# Altium schematic sheet bmsSlave_conn.SchDoc
size A; SheetNumber: 2; SheetTotal: 4
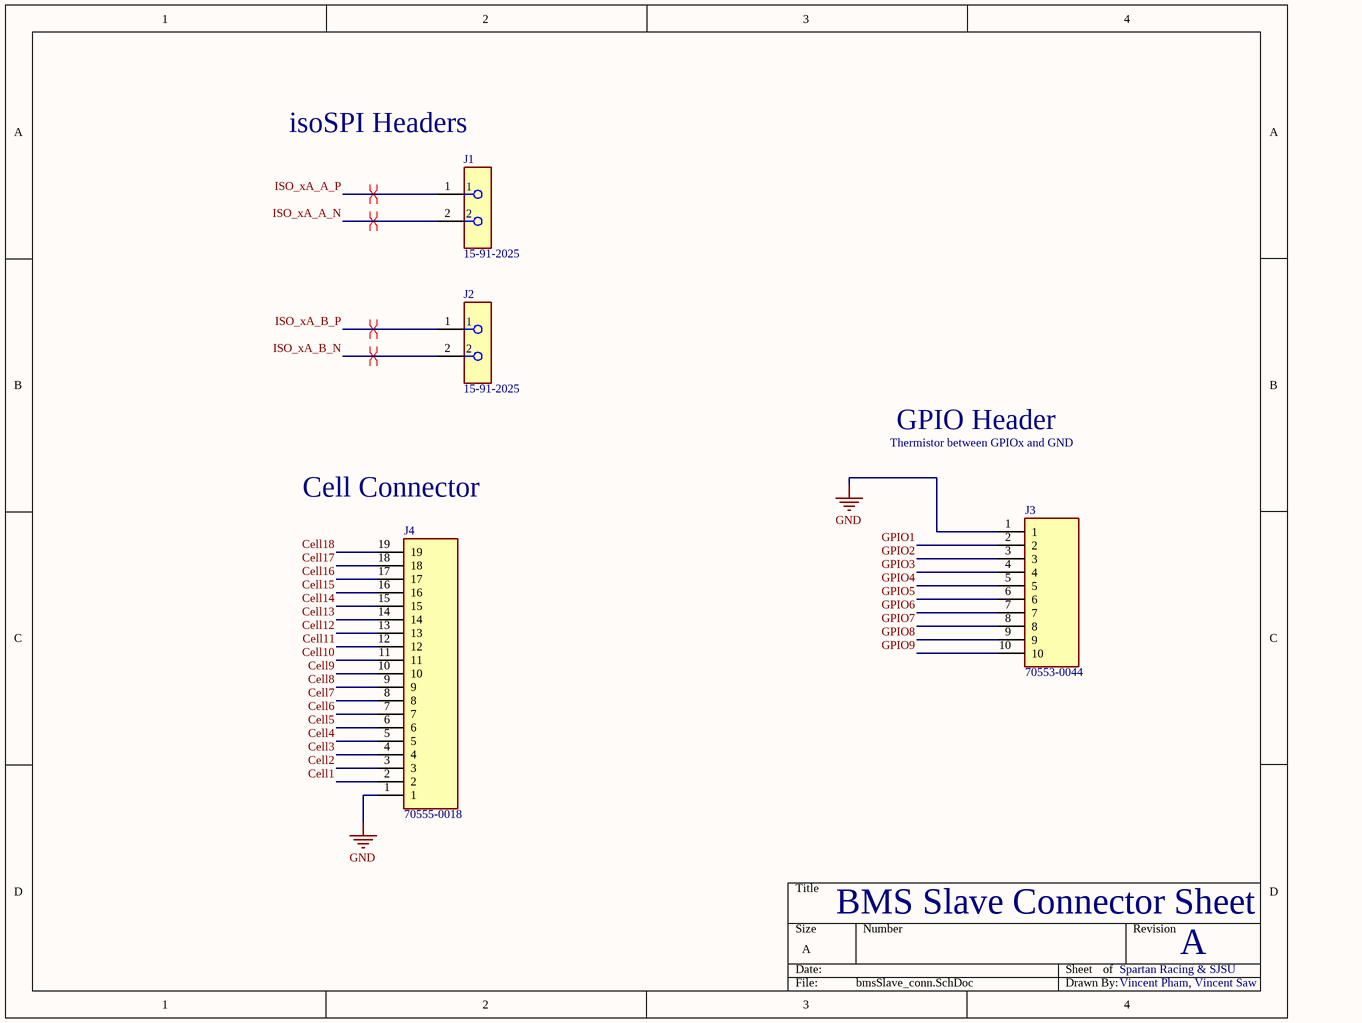
[diagram p0: bmsSlave_conn.SchDoc]

## Parts
J1  15-91-2025  [FP-15-91-2025-MFG]
J2  15-91-2025  [FP-15-91-2025-MFG]
J3  70553-0044  [705550044]
J4  70555-0018  [705550018]

## Nets
GND: J3.1 J4.1
Cell1: J4.2
Cell2: J4.3
Cell3: J4.4
Cell4: J4.5
Cell5: J4.6
Cell6: J4.7
Cell7: J4.8
Cell8: J4.9
Cell9: J4.10
Cell10: J4.11
Cell11: J4.12
Cell12: J4.13
Cell13: J4.14
Cell14: J4.15
Cell15: J4.16
Cell16: J4.17
Cell17: J4.18
Cell18: J4.19
GPIO1: J3.2
GPIO2: J3.3
GPIO3: J3.4
GPIO4: J3.5
GPIO5: J3.6
GPIO6: J3.7
GPIO7: J3.8
GPIO8: J3.9
GPIO9: J3.10
ISO_xA_A_N: J1.2
ISO_xA_A_P: J1.1
ISO_xA_B_N: J2.2
ISO_xA_B_P: J2.1

## Layout directives
differential pair: ISO_xA_A_N, ISO_xA_A_P, ISO_xA_B_N, ISO_xA_B_P

## Notes on the sheet
- isoSPI Headers
- GPIO Header
- (near J4) Cell Connector
- Thermistor between GPIOx and GND
- BMS Slave Connector Sheet
- Spartan Racing & SJSU
- A
- Vincent Pham, Vincent Saw

## Library data of the parts
J1 J2 = CMP-04776-000618-1: CONN HEADER SMD R/A 2POS 2.54MM; Number of Contacts: 2; Voltage Rating: 250V; Max Current Rating: 1.75A; Contact Resistance: 30mR; Current Rating: 3A; Insulation Resistance: 1GR; Gender: Male; Glow Wire Compliant: Non-compliant; Contact Mating Length: 0.24inch; Max Operating Temperature: 105°C; Length: 8.64mm; Color: Black; REACH SVHC: No SVHC; Depth: 13.59mm; ELV: Compliant; Material: Brass; Contact Type: Male Pin; Number of Rows: 1; Number of Positions: 2; Housing Color: Black; Pitch: 2.54mm; Housing Material: Polyester; Flammability Rating: UL94 V-0; Packaging: Rail/Tube; RoHS Compliant: Yes; Radiation Hardening: No; Min Operating Temperature: -40°C; Termination: Solder; Mount: Surface Mount; Contact Plating: Gold; Package Quantity: 1830; Height: 5.56mm; Contact Material: Bronze; Orientation: Right Angle; Number of Circuits: 2; Lead Free: Contains Lead; Voltage Rating (DC): 250V; Series: C-Grid® SL™ 70634; Contact Gender: Male
J3 = 70553-0044: Connector; Manufacturer_Name: Molex; Datasheet Link: https://www.molex.com/pdm_docs/sd/705530044_sd.pdf; Height: 7.12mm; Manufacturer_Part_Number: 70553-0044; Mouser Part Number: 538-70553-0044; Mouser Price/Stock: https://www.mouser.co.uk/ProductDetail/Molex/70553-0044?qs=MYfYmQ4RRgbAysUAVOcSCQ%3D%3D
J4 = 70555-0018: Connector; Manufacturer_Name: Molex; Datasheet Link: https://www.molex.com/pdm_docs/sd/705550018_sd.pdf; Height: 7mm; Manufacturer_Part_Number: 70555-0018